# EasyEDA schematic SCH_MiniPrintV1_2025-03-26.json
TITLE: Sheet_1; REV: 1.0; Date: 2025-03-24; Sheet: 1/1; Drawn By: akhil.arp2019; Company: Your Company
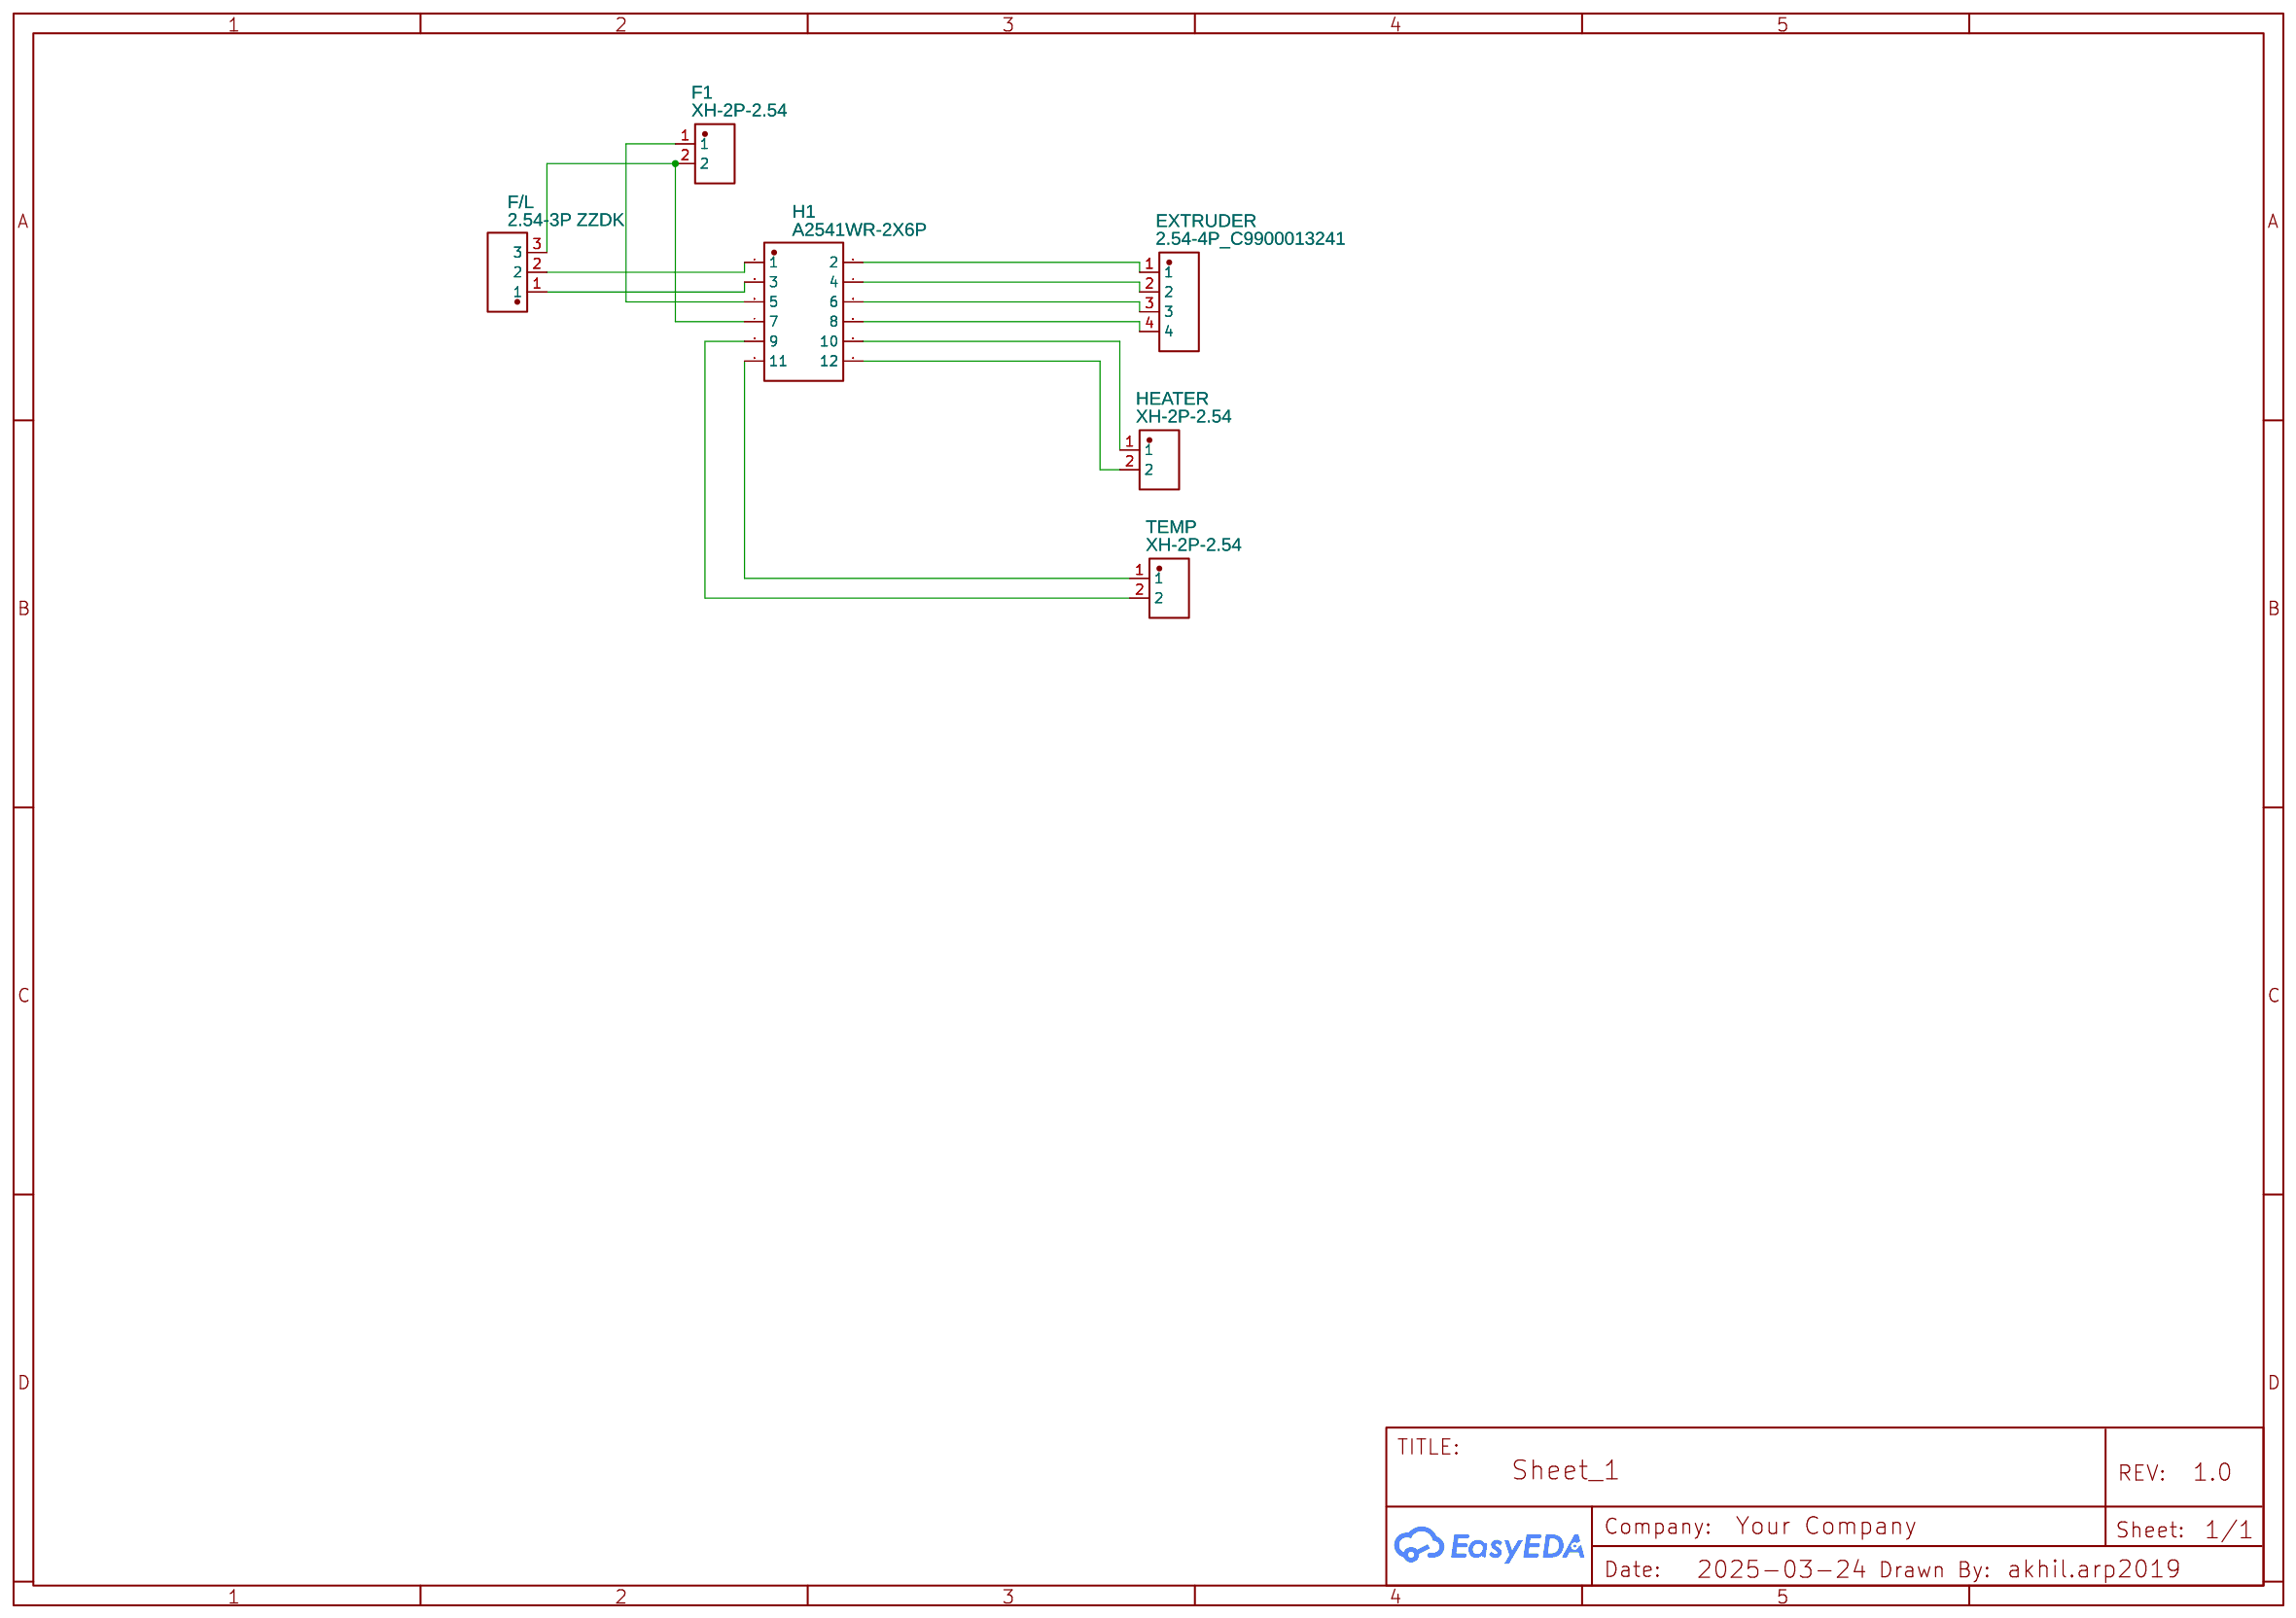
[diagram p0: schematic sheet]

## Parts
EXTRUDER  2.54-4P_C9900013241  [CONN-TH_B4B-XH-A-BK-LF-SN]
F1  XH-2P-2.54  [CONN-TH_2P-P2.50-XH2.54-2P]
F/L  2.54-3P ZZDK  [HDR-TH_3P-P2.50-V-F-2]
H1  A2541WR-2X6P  [CONN-TH_A2541WR-2X6P]
HEATER  XH-2P-2.54  [CONN-TH_2P-P2.50-XH2.54-2P]
TEMP  XH-2P-2.54  [CONN-TH_2P-P2.50-XH2.54-2P]

## Library data of the parts
EXTRUDER = 2.54-4P_C9900013241: Contributor: lcsc; Supplier: LCSC; Supplier Part: C9900013241; Manufacturer: null; Manufacturer Part: 2.54-4P; JLCPCB Part Class: Extended Part
F1 HEATER TEMP = XH-2P-2.54: Contributor: LCSC; Convert to PCB: Yes; Add into BOM: Yes; Supplier: LCSC; Supplier Part: C9900003929; Manufacturer: null; JLCPCB Part Class: Extended Part
F/L = 2.54-3P ZZDK: Supplier: LCSC; Supplier Part: C18185650; Manufacturer: SHOU HAN(首韩); Contributor: lcsc
H1 = A2541WR-2X6P: Contributor: LCSC; Supplier: LCSC; Supplier Part: C239337; Manufacturer: CJT(长江连接器); Manufacturer Part: A2541WR-2x6P; JLCPCB Part Class: Extended Part

## Nets
Net-(EXTRUDER-1): EXTRUDER.1 H1.2
Net-(EXTRUDER-2): EXTRUDER.2 H1.4
Net-(EXTRUDER-3): EXTRUDER.3 H1.6
Net-(EXTRUDER-4): EXTRUDER.4 H1.8
Net-(F1-1): F1.1 H1.5
Net-(F1-2): F1.2 F/L.3 H1.7
Net-(F/L-1): F/L.1 H1.3
Net-(F/L-2): F/L.2 H1.1
Net-(H1-9): H1.9 TEMP.2
Net-(H1-10): H1.10 HEATER.1
Net-(H1-11): H1.11 TEMP.1
Net-(H1-12): H1.12 HEATER.2
